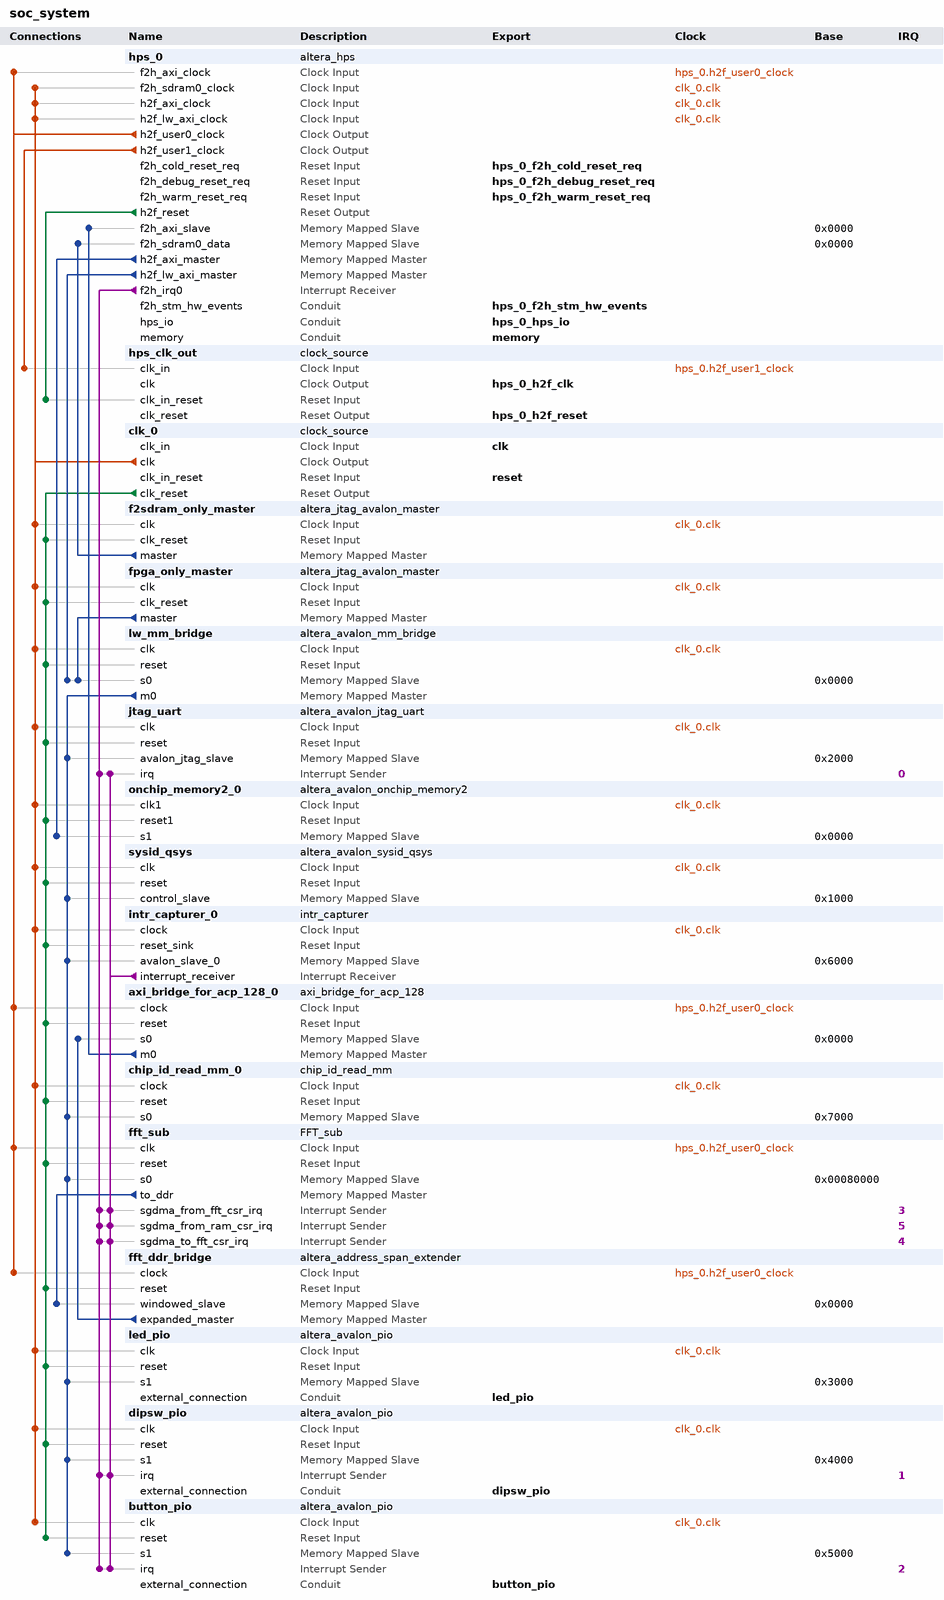
[diagram p0: system contents]
# Platform Designer (Qsys) system soc_system, Cyclone V 5CSEMA4U23C6
# Parameters at their usual value, and those the tool derives, are not listed.
package require -exact qsys 20.1
create_system soc_system
set_project_property DEVICE_FAMILY {Cyclone V}
set_project_property DEVICE 5CSEMA4U23C6

add_instance hps_0 altera_hps 20.1
set_instance_parameter_value hps_0 EMAC1_Mode RGMII
set_instance_parameter_value hps_0 EMAC1_PinMuxing {HPS I/O Set 0}
set_instance_parameter_value hps_0 F2SCLK_COLDRST_Enable true
set_instance_parameter_value hps_0 F2SCLK_DBGRST_Enable true
set_instance_parameter_value hps_0 F2SCLK_WARMRST_Enable true
set_instance_parameter_value hps_0 F2SDRAM_Type AXI-3
set_instance_parameter_value hps_0 F2SDRAM_Width 64
set_instance_parameter_value hps_0 F2SINTERRUPT_Enable true
set_instance_parameter_value hps_0 F2S_Width 3
set_instance_parameter_value hps_0 FPGA_PERIPHERAL_OUTPUT_CLOCK_FREQ_EMAC0_GTX_CLK 100
set_instance_parameter_value hps_0 FPGA_PERIPHERAL_OUTPUT_CLOCK_FREQ_EMAC0_MD_CLK 100.0
set_instance_parameter_value hps_0 FPGA_PERIPHERAL_OUTPUT_CLOCK_FREQ_EMAC1_GTX_CLK 100
set_instance_parameter_value hps_0 FPGA_PERIPHERAL_OUTPUT_CLOCK_FREQ_EMAC1_MD_CLK 100.0
set_instance_parameter_value hps_0 HPS_PROTOCOL DDR3
set_instance_parameter_value hps_0 I2C0_Mode I2C
set_instance_parameter_value hps_0 I2C0_PinMuxing {HPS I/O Set 0}
set_instance_parameter_value hps_0 I2C1_Mode I2C
set_instance_parameter_value hps_0 I2C1_PinMuxing {HPS I/O Set 0}
set_instance_parameter_value hps_0 LWH2F_Enable true
set_instance_parameter_value hps_0 MEM_BANKADDR_WIDTH 3
set_instance_parameter_value hps_0 MEM_CLK_FREQ 400.0
set_instance_parameter_value hps_0 MEM_COL_ADDR_WIDTH 10
set_instance_parameter_value hps_0 MEM_DQ_WIDTH 32
set_instance_parameter_value hps_0 MEM_DRV_STR RZQ/6
set_instance_parameter_value hps_0 MEM_ROW_ADDR_WIDTH 15
set_instance_parameter_value hps_0 MEM_RTT_NOM RZQ/6
set_instance_parameter_value hps_0 MEM_RTT_WR {Dynamic ODT off}
set_instance_parameter_value hps_0 MEM_TCL 7
set_instance_parameter_value hps_0 MEM_TFAW_NS 37.5
set_instance_parameter_value hps_0 MEM_TRAS_NS 35.0
set_instance_parameter_value hps_0 MEM_TRCD_NS 13.75
set_instance_parameter_value hps_0 MEM_TRFC_NS 300.0
set_instance_parameter_value hps_0 MEM_TRP_NS 13.75
set_instance_parameter_value hps_0 MEM_VENDOR Other
set_instance_parameter_value hps_0 MEM_WTCL 7
set_instance_parameter_value hps_0 QSPI_Mode N/A
set_instance_parameter_value hps_0 QSPI_PinMuxing Unused
set_instance_parameter_value hps_0 REF_CLK_FREQ 25.0
set_instance_parameter_value hps_0 S2FCLK_USER0CLK_Enable true
set_instance_parameter_value hps_0 S2FCLK_USER1CLK_Enable true
set_instance_parameter_value hps_0 S2FCLK_USER1CLK_FREQ 50.0
set_instance_parameter_value hps_0 S2FCLK_USER2CLK 5
set_instance_parameter_value hps_0 S2F_Width 2
set_instance_parameter_value hps_0 SDIO_Mode {4-bit Data}
set_instance_parameter_value hps_0 SDIO_PinMuxing {HPS I/O Set 0}
set_instance_parameter_value hps_0 SPIM1_Mode {Single Slave Select}
set_instance_parameter_value hps_0 SPIM1_PinMuxing {HPS I/O Set 0}
set_instance_parameter_value hps_0 STM_Enable true
set_instance_parameter_value hps_0 TIMING_BOARD_AC_SKEW 0.02
set_instance_parameter_value hps_0 TIMING_BOARD_AC_TO_CK_SKEW 0.0
set_instance_parameter_value hps_0 TIMING_BOARD_DQ_TO_DQS_SKEW 0.0
set_instance_parameter_value hps_0 TIMING_BOARD_MAX_CK_DELAY 0.6
set_instance_parameter_value hps_0 TIMING_BOARD_MAX_DQS_DELAY 0.6
set_instance_parameter_value hps_0 TIMING_BOARD_SKEW_BETWEEN_DQS 0.02
set_instance_parameter_value hps_0 TIMING_BOARD_SKEW_CKDQS_DIMM_MAX 0.01
set_instance_parameter_value hps_0 TIMING_BOARD_SKEW_CKDQS_DIMM_MIN -0.01
set_instance_parameter_value hps_0 TIMING_BOARD_SKEW_WITHIN_DQS 0.02
set_instance_parameter_value hps_0 TIMING_TDH 125
set_instance_parameter_value hps_0 TIMING_TDQSCK 400
set_instance_parameter_value hps_0 TIMING_TDQSQ 120
set_instance_parameter_value hps_0 TIMING_TDS 50
set_instance_parameter_value hps_0 TIMING_TIH 250
set_instance_parameter_value hps_0 TIMING_TIS 175
set_instance_parameter_value hps_0 TIMING_TQSH 0.38
set_instance_parameter_value hps_0 UART0_Mode {No Flow Control}
set_instance_parameter_value hps_0 UART0_PinMuxing {HPS I/O Set 0}
set_instance_parameter_value hps_0 USB1_Mode SDR
set_instance_parameter_value hps_0 USB1_PinMuxing {HPS I/O Set 0}
set_instance_parameter_value hps_0 desired_cfg_clk_mhz 100.0
set_instance_parameter_value hps_0 desired_qspi_clk_mhz 370.0

add_instance hps_clk_out clock_source 20.1
set_instance_parameter_value hps_clk_out clockFrequency 50000000

add_instance clk_0 clock_source 20.1
set_instance_parameter_value clk_0 clockFrequency 50000000

add_instance f2sdram_only_master altera_jtag_avalon_master 20.1

add_instance fpga_only_master altera_jtag_avalon_master 20.1

add_instance lw_mm_bridge altera_avalon_mm_bridge 20.1
set_instance_parameter_value lw_mm_bridge ADDRESS_UNITS SYMBOLS
set_instance_parameter_value lw_mm_bridge ADDRESS_WIDTH 10
set_instance_parameter_value lw_mm_bridge DATA_WIDTH 32
set_instance_parameter_value lw_mm_bridge MAX_PENDING_RESPONSES 4
set_instance_parameter_value lw_mm_bridge USE_AUTO_ADDRESS_WIDTH 1

add_instance jtag_uart altera_avalon_jtag_uart 20.1
set_instance_parameter_value jtag_uart allowMultipleConnections true
set_instance_parameter_value jtag_uart simInteractiveOptions INTERACTIVE_ASCII_OUTPUT

add_instance onchip_memory2_0 altera_avalon_onchip_memory2 20.1
set_instance_parameter_value onchip_memory2_0 dataWidth 32
set_instance_parameter_value onchip_memory2_0 dualPort false
set_instance_parameter_value onchip_memory2_0 initMemContent true
set_instance_parameter_value onchip_memory2_0 initializationFileName onchip_mem.hex
set_instance_parameter_value onchip_memory2_0 memorySize 32768

add_instance sysid_qsys altera_avalon_sysid_qsys 20.1
set_instance_parameter_value sysid_qsys id -1395321854

add_instance intr_capturer_0 intr_capturer 1.0

add_instance axi_bridge_for_acp_128_0 axi_bridge_for_acp_128 1.0

add_instance chip_id_read_mm_0 chip_id_read_mm 1.0

add_instance fft_sub FFT_sub 1.0

add_instance fft_ddr_bridge altera_address_span_extender 20.1
set_instance_parameter_value fft_ddr_bridge BURSTCOUNT_WIDTH 5
set_instance_parameter_value fft_ddr_bridge DATA_WIDTH 128
set_instance_parameter_value fft_ddr_bridge ENABLE_SLAVE_PORT true
set_instance_parameter_value fft_ddr_bridge MASTER_ADDRESS_DEF 2147483648
set_instance_parameter_value fft_ddr_bridge MAX_PENDING_READS 8
set_instance_parameter_value fft_ddr_bridge SLAVE_ADDRESS_WIDTH 26

add_instance led_pio altera_avalon_pio 20.1
set_instance_parameter_value led_pio direction Output
set_instance_parameter_value led_pio width 8

add_instance dipsw_pio altera_avalon_pio 20.1
set_instance_parameter_value dipsw_pio bitClearingEdgeCapReg true
set_instance_parameter_value dipsw_pio captureEdge true
set_instance_parameter_value dipsw_pio direction Input
set_instance_parameter_value dipsw_pio edgeType ANY
set_instance_parameter_value dipsw_pio generateIRQ true
set_instance_parameter_value dipsw_pio irqType EDGE
set_instance_parameter_value dipsw_pio width 4

add_instance button_pio altera_avalon_pio 20.1
set_instance_parameter_value button_pio bitClearingEdgeCapReg true
set_instance_parameter_value button_pio captureEdge true
set_instance_parameter_value button_pio direction Input
set_instance_parameter_value button_pio edgeType FALLING
set_instance_parameter_value button_pio generateIRQ true
set_instance_parameter_value button_pio irqType EDGE
set_instance_parameter_value button_pio width 2

# connections
add_connection clk_0.clk button_pio.clk clock
add_connection clk_0.clk chip_id_read_mm_0.clock clock
add_connection clk_0.clk dipsw_pio.clk clock
add_connection clk_0.clk f2sdram_only_master.clk clock
add_connection clk_0.clk fpga_only_master.clk clock
add_connection clk_0.clk hps_0.f2h_sdram0_clock clock
add_connection clk_0.clk hps_0.h2f_axi_clock clock
add_connection clk_0.clk hps_0.h2f_lw_axi_clock clock
add_connection clk_0.clk intr_capturer_0.clock clock
add_connection clk_0.clk jtag_uart.clk clock
add_connection clk_0.clk led_pio.clk clock
add_connection clk_0.clk lw_mm_bridge.clk clock
add_connection clk_0.clk onchip_memory2_0.clk1 clock
add_connection clk_0.clk sysid_qsys.clk clock
add_connection hps_0.h2f_user0_clock axi_bridge_for_acp_128_0.clock clock
add_connection hps_0.h2f_user0_clock fft_ddr_bridge.clock clock
add_connection hps_0.h2f_user0_clock fft_sub.clk clock
add_connection hps_0.h2f_user0_clock hps_0.f2h_axi_clock clock
add_connection hps_0.h2f_user1_clock hps_clk_out.clk_in clock
add_connection clk_0.clk_reset axi_bridge_for_acp_128_0.reset reset
add_connection clk_0.clk_reset button_pio.reset reset
add_connection clk_0.clk_reset chip_id_read_mm_0.reset reset
add_connection clk_0.clk_reset dipsw_pio.reset reset
add_connection clk_0.clk_reset f2sdram_only_master.clk_reset reset
add_connection clk_0.clk_reset fft_ddr_bridge.reset reset
add_connection clk_0.clk_reset fft_sub.reset reset
add_connection clk_0.clk_reset fpga_only_master.clk_reset reset
add_connection clk_0.clk_reset intr_capturer_0.reset_sink reset
add_connection clk_0.clk_reset jtag_uart.reset reset
add_connection clk_0.clk_reset led_pio.reset reset
add_connection clk_0.clk_reset lw_mm_bridge.reset reset
add_connection clk_0.clk_reset onchip_memory2_0.reset1 reset
add_connection clk_0.clk_reset sysid_qsys.reset reset
add_connection hps_0.h2f_reset hps_clk_out.clk_in_reset reset
add_connection axi_bridge_for_acp_128_0.m0 hps_0.f2h_axi_slave avalon
set_connection_parameter_value axi_bridge_for_acp_128_0.m0/hps_0.f2h_axi_slave baseAddress 0x0000
add_connection f2sdram_only_master.master hps_0.f2h_sdram0_data avalon
set_connection_parameter_value f2sdram_only_master.master/hps_0.f2h_sdram0_data baseAddress 0x0000
add_connection fft_ddr_bridge.expanded_master axi_bridge_for_acp_128_0.s0 avalon
set_connection_parameter_value fft_ddr_bridge.expanded_master/axi_bridge_for_acp_128_0.s0 baseAddress 0x0000
add_connection fft_sub.to_ddr fft_ddr_bridge.windowed_slave avalon
set_connection_parameter_value fft_sub.to_ddr/fft_ddr_bridge.windowed_slave baseAddress 0x0000
add_connection fpga_only_master.master lw_mm_bridge.s0 avalon
set_connection_parameter_value fpga_only_master.master/lw_mm_bridge.s0 baseAddress 0x0000
add_connection hps_0.h2f_axi_master onchip_memory2_0.s1 avalon
set_connection_parameter_value hps_0.h2f_axi_master/onchip_memory2_0.s1 baseAddress 0x0000
add_connection hps_0.h2f_lw_axi_master lw_mm_bridge.s0 avalon
set_connection_parameter_value hps_0.h2f_lw_axi_master/lw_mm_bridge.s0 baseAddress 0x0000
add_connection lw_mm_bridge.m0 button_pio.s1 avalon
set_connection_parameter_value lw_mm_bridge.m0/button_pio.s1 baseAddress 0x5000
add_connection lw_mm_bridge.m0 chip_id_read_mm_0.s0 avalon
set_connection_parameter_value lw_mm_bridge.m0/chip_id_read_mm_0.s0 baseAddress 0x7000
add_connection lw_mm_bridge.m0 dipsw_pio.s1 avalon
set_connection_parameter_value lw_mm_bridge.m0/dipsw_pio.s1 baseAddress 0x4000
add_connection lw_mm_bridge.m0 fft_sub.s0 avalon
set_connection_parameter_value lw_mm_bridge.m0/fft_sub.s0 baseAddress 0x00080000
add_connection lw_mm_bridge.m0 intr_capturer_0.avalon_slave_0 avalon
set_connection_parameter_value lw_mm_bridge.m0/intr_capturer_0.avalon_slave_0 baseAddress 0x6000
add_connection lw_mm_bridge.m0 jtag_uart.avalon_jtag_slave avalon
set_connection_parameter_value lw_mm_bridge.m0/jtag_uart.avalon_jtag_slave baseAddress 0x2000
add_connection lw_mm_bridge.m0 led_pio.s1 avalon
set_connection_parameter_value lw_mm_bridge.m0/led_pio.s1 baseAddress 0x3000
add_connection lw_mm_bridge.m0 sysid_qsys.control_slave avalon
set_connection_parameter_value lw_mm_bridge.m0/sysid_qsys.control_slave baseAddress 0x1000
add_connection hps_0.f2h_irq0 button_pio.irq interrupt
set_connection_parameter_value hps_0.f2h_irq0/button_pio.irq irqNumber 2
add_connection hps_0.f2h_irq0 dipsw_pio.irq interrupt
set_connection_parameter_value hps_0.f2h_irq0/dipsw_pio.irq irqNumber 1
add_connection hps_0.f2h_irq0 fft_sub.sgdma_from_fft_csr_irq interrupt
set_connection_parameter_value hps_0.f2h_irq0/fft_sub.sgdma_from_fft_csr_irq irqNumber 3
add_connection hps_0.f2h_irq0 fft_sub.sgdma_from_ram_csr_irq interrupt
set_connection_parameter_value hps_0.f2h_irq0/fft_sub.sgdma_from_ram_csr_irq irqNumber 5
add_connection hps_0.f2h_irq0 fft_sub.sgdma_to_fft_csr_irq interrupt
set_connection_parameter_value hps_0.f2h_irq0/fft_sub.sgdma_to_fft_csr_irq irqNumber 4
add_connection hps_0.f2h_irq0 jtag_uart.irq interrupt
set_connection_parameter_value hps_0.f2h_irq0/jtag_uart.irq irqNumber 0
add_connection intr_capturer_0.interrupt_receiver button_pio.irq interrupt
set_connection_parameter_value intr_capturer_0.interrupt_receiver/button_pio.irq irqNumber 2
add_connection intr_capturer_0.interrupt_receiver dipsw_pio.irq interrupt
set_connection_parameter_value intr_capturer_0.interrupt_receiver/dipsw_pio.irq irqNumber 1
add_connection intr_capturer_0.interrupt_receiver fft_sub.sgdma_from_fft_csr_irq interrupt
set_connection_parameter_value intr_capturer_0.interrupt_receiver/fft_sub.sgdma_from_fft_csr_irq irqNumber 3
add_connection intr_capturer_0.interrupt_receiver fft_sub.sgdma_from_ram_csr_irq interrupt
set_connection_parameter_value intr_capturer_0.interrupt_receiver/fft_sub.sgdma_from_ram_csr_irq irqNumber 5
add_connection intr_capturer_0.interrupt_receiver fft_sub.sgdma_to_fft_csr_irq interrupt
set_connection_parameter_value intr_capturer_0.interrupt_receiver/fft_sub.sgdma_to_fft_csr_irq irqNumber 4
add_connection intr_capturer_0.interrupt_receiver jtag_uart.irq interrupt
set_connection_parameter_value intr_capturer_0.interrupt_receiver/jtag_uart.irq irqNumber 0

# exported interfaces
add_interface button_pio conduit end
set_interface_property button_pio EXPORT_OF button_pio.external_connection
add_interface clk clock sink
set_interface_property clk EXPORT_OF clk_0.clk_in
add_interface dipsw_pio conduit end
set_interface_property dipsw_pio EXPORT_OF dipsw_pio.external_connection
add_interface hps_0_f2h_cold_reset_req reset sink
set_interface_property hps_0_f2h_cold_reset_req EXPORT_OF hps_0.f2h_cold_reset_req
add_interface hps_0_f2h_debug_reset_req reset sink
set_interface_property hps_0_f2h_debug_reset_req EXPORT_OF hps_0.f2h_debug_reset_req
add_interface hps_0_f2h_stm_hw_events conduit end
set_interface_property hps_0_f2h_stm_hw_events EXPORT_OF hps_0.f2h_stm_hw_events
add_interface hps_0_f2h_warm_reset_req reset sink
set_interface_property hps_0_f2h_warm_reset_req EXPORT_OF hps_0.f2h_warm_reset_req
add_interface hps_0_h2f_clk clock source
set_interface_property hps_0_h2f_clk EXPORT_OF hps_clk_out.clk
add_interface hps_0_h2f_reset reset source
set_interface_property hps_0_h2f_reset EXPORT_OF hps_clk_out.clk_reset
add_interface hps_0_hps_io conduit end
set_interface_property hps_0_hps_io EXPORT_OF hps_0.hps_io
add_interface led_pio conduit end
set_interface_property led_pio EXPORT_OF led_pio.external_connection
add_interface memory conduit end
set_interface_property memory EXPORT_OF hps_0.memory
add_interface reset reset sink
set_interface_property reset EXPORT_OF clk_0.clk_in_reset

set_interconnect_requirement {$system} qsys_mm.clockCrossingAdapter HANDSHAKE
set_interconnect_requirement {$system} qsys_mm.enableEccProtection FALSE
set_interconnect_requirement {$system} qsys_mm.insertDefaultSlave FALSE
set_interconnect_requirement {$system} qsys_mm.maxAdditionalLatency 0

save_system soc_system.qsys
